# Altium project STPedal.PrjPcb
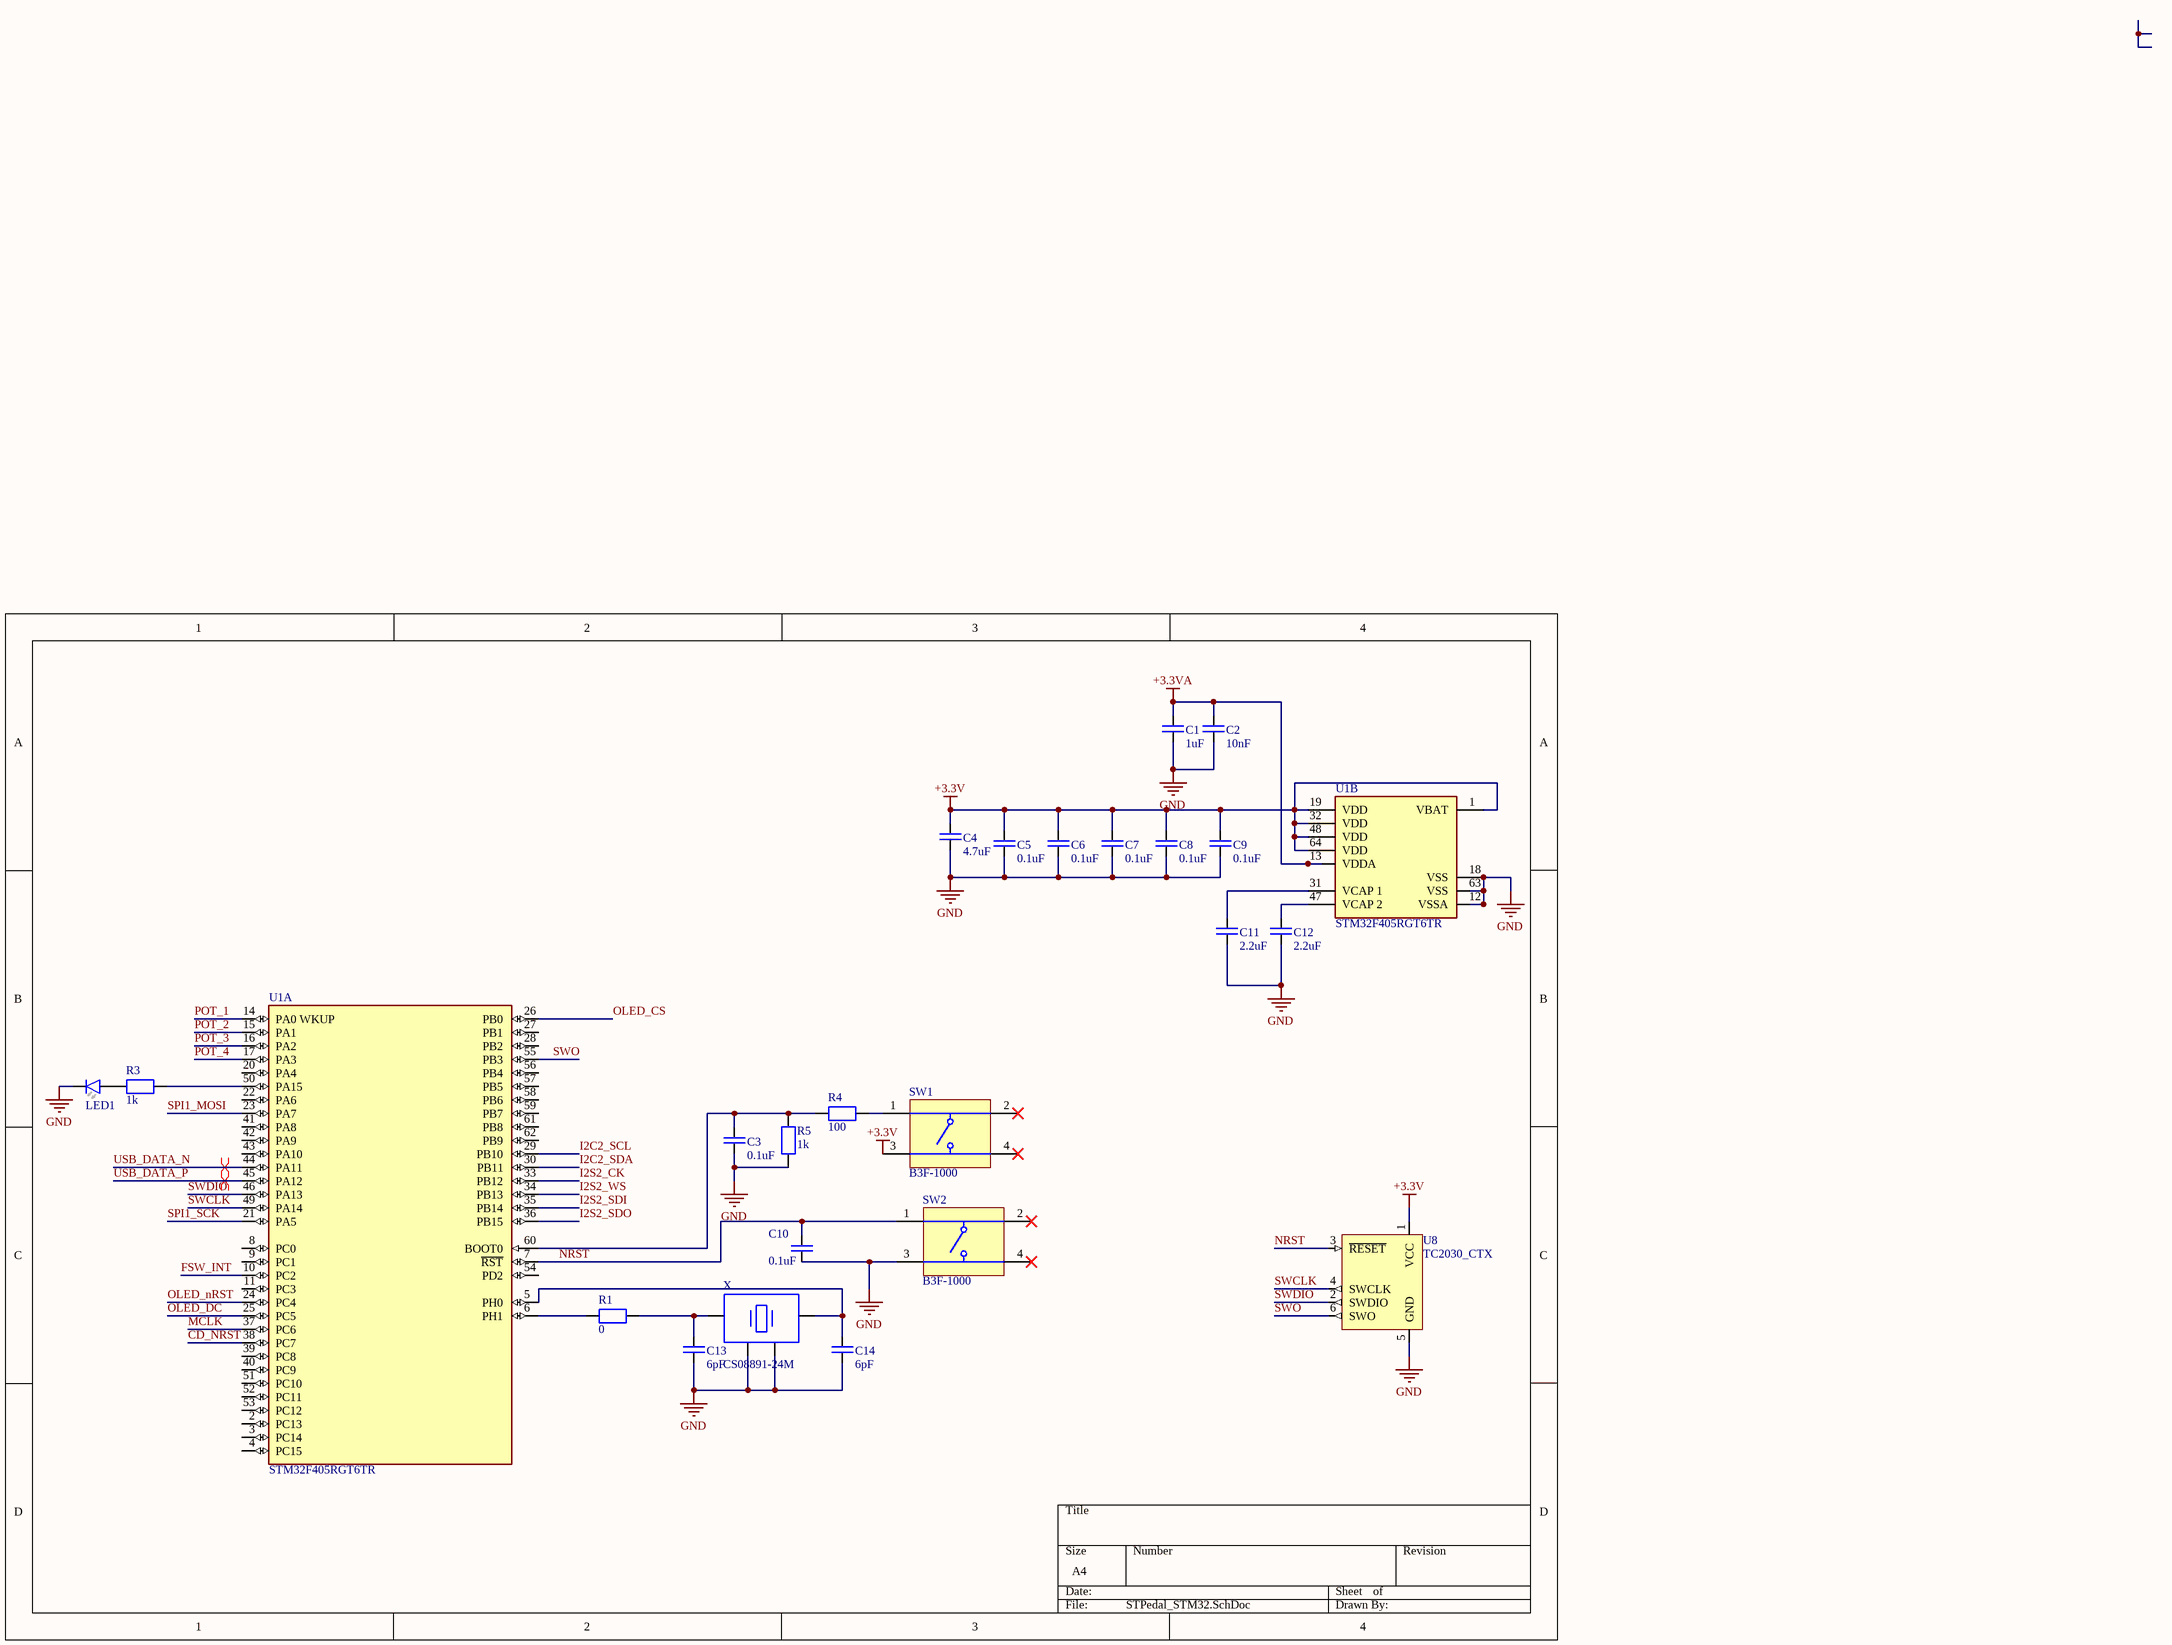
[diagram p0: STPedal_STM32.SchDoc]
4 sheets, 146 parts. Net scope: global (net labels, ports and power ports of the same name join across sheets).
Board file: STPedal.PcbDoc
Sheets:
  STPedal_STM32.SchDoc
  STPedal_Audio.SchDoc
  STPedal_Power.SchDoc
  STPedal_Peripherals.SchDoc

## Sheet STPedal_STM32.SchDoc
size A4; SheetNumber: 1; SheetTotal: 4

### Parts
C1  1uF  [CAPC_0402_1005X55N]
C2  10nF  [CAPC_0402_1005X55N]
C3  0.1uF  [CAPC_0402_1005X55N]
C4  4.7uF  [CAPC_0402_1005X55N]
C5  0.1uF  [CAPC_0402_1005X55N]
C6  0.1uF  [CAPC_0402_1005X55N]
C7  0.1uF  [CAPC_0402_1005X55N]
C8  0.1uF  [CAPC_0402_1005X55N]
C9  0.1uF  [CAPC_0402_1005X55N]
C10  0.1uF  [CAPC_0402_1005X55N]
C11  2.2uF  [CAPC_0402_1005X55N]
C12  2.2uF  [CAPC_0402_1005X55N]
C13  6pF  [CAPC_0402_1005X55N]
C14  6pF  [CAPC_0402_1005X55N]
LED1  LED_White_JLCD_0603  [LED_0603_1608]  (value not drawn)
R1  0  [RESC_0402_1005X40N]
R3  1k  [RESC_0402_1005X40N]
R4  100  [RESC_0402_1005X40N]
R5  1k  [RESC_0402_1005X40N]
SW1  B3F-1000  [OMRON-B3F-1000-4_V]
SW2  B3F-1000  [OMRON-B3F-1000-4_V]
U1  STM32F405RGT6TR  [FP-LQFP64-5W-IPC_C]  (parts A,B of 2)
U8  TC2030_CTX  [TC2030_CTX]  (no BOM)
X  CS08891-24M  [4 SMD - No Lead]

### Nets
+3.3V: C4.2 C5.2 C6.2 C7.2 C8.2 C9.2 SW1.3 U1.1(VBAT) U1.19(VDD) U1.32(VDD) U1.48(VDD) U1.64(VDD) U8.1(VCC)
+3.3VA: C1.2 C2.2 U1.13(VDDA)
GND: C1.1 C2.1 C3.1 C4.1 C5.1 C6.1 C7.1 C8.1 C9.1 C10.1 C11.1 C12.1 C13.1 C14.1 LED1.2 R5.1 SW2.3 U1.12(VSSA) U1.18(VSS) U1.63(VSS) U8.5(GND) X.2 X.4
CD_NRST: U1.38(PC7)
FSW_INT: U1.10(PC2)
I2C2_SCL: U1.29(PB10)
I2C2_SDA: U1.30(PB11)
I2S2_CK: U1.33(PB12)
I2S2_SDI: U1.35(PB14)
I2S2_SDO: U1.36(PB15)
I2S2_WS: U1.34(PB13)
MCLK: U1.37(PC6)
NRST: C10.2 SW2.1 U1.7(~{RST}) U8.3(~{RESET})
OLED_CS: U1.26(PB0)
OLED_DC: U1.25(PC5)
OLED_nRST: U1.24(PC4)
POT_1: U1.14(PA0_WKUP)
POT_2: U1.15(PA1)
POT_3: U1.16(PA2)
POT_4: U1.17(PA3)
SPI1_MOSI: U1.23(PA7)
SPI1_SCK: U1.21(PA5)
SWCLK: U1.49(PA14) U8.4(SWCLK)
SWDIO: U1.46(PA13) U8.2(SWDIO)
SWO: U1.55(PB3) U8.6(SWO)
USB_DATA_N: U1.44(PA11)
USB_DATA_P: U1.45(PA12)
NetC3_2: C3.2 R4.1 R5.2 U1.60(BOOT0)
NetC11_2: C11.2 U1.31(VCAP_1)
NetC12_2: C12.2 U1.47(VCAP_2)
NetC13_2: C13.2 R1.2 X.1
NetC14_2: C14.2 U1.5(PH0) X.3
NetLED1_1: LED1.1 R3.1
NetR1_1: R1.1 U1.6(PH1)
NetR3_2: R3.2 U1.50(PA15)
NetR4_2: R4.2 SW1.1

Not connected (* = marked no-connect by the designer): SW1 2* 4*; SW2 2* 4*; U1 2(PC13) 3(PC14) 4(PC15) 8(PC0) 9(PC1) 11(PC3) 20(PA4) 22(PA6) 27(PB1) 28(PB2) 39(PC8) 40(PC9) 41(PA8) 42(PA9) 43(PA10) 51(PC10) 52(PC11) 53(PC12) 54(PD2) 56(PB4) 57(PB5) 58(PB6) 59(PB7) 61(PB8) 62(PB9)

### Layout directives
differential pair: USB_DATA_N, USB_DATA_P

### Library data of the parts
C1 = 1uF_CAP_0402: Capacitor 0402 - 1uF +-/10% / 25V; Manufacturer: Samsung Electro-Mechanics; MPN: CL05A105KA5NQNC; LCSC: C52923
C2 = 10nF_CAP_0402: Capacitor 0402 - 10nF +-/10% / 25V; Manufacturer: Samsung Electro-Mechanics; MPN: CL05B103KB5NNNC; LCSC: C15195
C3 C5-C10 = 0.1uF_CAP_0402: Capacitor 0402 - 0.1uF +-/10% / 16V; Manufacturer: Samsung Electro-Mechanics; MPN: CL05B104KO5NNNC; LCSC: C1525
C4 = 4.7uF_CAP_0402: Capacitor 0402 - 4.7uF +-/20% / 10V; Manufacturer: Samsung Electro-Mechanics; MPN: CL05A475MP5NRNC; LCSC: C23733
C11 C12 = 2.2uF_CAP_0402: Capacitor 0402 - 2.2uF +-/10% / 25V; Manufacturer: Samsung Electro-Mechanics; MPN: CL05A225MQ5NSNC; LCSC: C12530
C13 C14 = 6pF_CAP_0402: Capacitor 0402 - 6pF +-/10% / 50V - C0G; Manufacturer: FH (Guangdong Fenghua Advanced Tech); MPN: 0402CG6R0C500NT; LCSC: C1575
LED1 = LED_White_JLCD_0603: -40℃~+85℃ 100mW 120° 2.6V~3.1V 360mcd 5mA Discrete Diode Top-mount White Yellow Lens 0603 LED Indication - Discrete ROHS; Manufacturer: Hubei KENTO Elec; MPN: KT-0603W; LCSC: C2290
R1 = 0R_JLCRES-0402: -55℃~+155℃ 0Ω 50V 62.5mW Thick Film Resistor ±1% ±800ppm/℃ 0402 Chip Resistor - Surface Mount ROHS; Manufacturer: UNI-ROYAL(Uniroyal Elec); MPN: 0402WGF0000TCE; LCSC: C17168
R3 R5 = 1k_JLCRES-0402: Resistor 0402 - 1k; Manufacturer: UNI-ROYAL(Uniroyal Elec); MPN: 0402WGF1001TCE; LCSC: C11702
R4 = 100R_JLCRES-0402: Resistor 0402 - 100R; Manufacturer: *; MPN: *; LCSC: C25076
SW1 SW2 = CMP-011-00004-2: Tactile Switch, SPST-NO, 0.05 A, 24 V, -25 to 70 degC, 4-Pin THD, RoHS, Bulk; Manufacturer: Omron Electronic Components; Throw Configuration: SPST; Max Contact Resistance: 100mohm; Resistance: 0.1Ohm; Max Current Rating: 50mA; Voltage Rating: 24V; Operating Force: 100gf; Datasheet Version: Jan-15; Case/Package: B3F-1000; Packaging: Bulk; Package Description: 4-Pin Through Hole Device, Body 6 x 6 mm; Manufacturer URL: http://www.omron.com/; Package Reference: B3F-1000; Contact Plating: Gold; Contact Current Rating: 50mA; RoHS Compliant: True; Contact Material: Gold; Mounting Technology: TH; Max Operating Temperature: 70°C; Min Operating Temperature: -25°C; Package Quantity: 1500; Datasheet URL: http://www.omron.com/ecb/products/pdf/en-b3f.pdf; Voltage Rating (DC): 24V; Pins: 4; Current Rating: 50mA; Max Voltage Rating (DC): 24V
U1 = CMP-0243-00156-2: IC MCU 32BIT 1MB FLASH 64LQFP; Frequency: 168MHz; Number of SPI Channels: 3; Oscillator Type: Internal; Core Architecture: ARM; Number of UART Channels: 2; Max Supply Voltage: 3.6V; Watchdog Timer: Yes; RAM Size: 196KB; Interface: I2C; Max Power Dissipation: 435mW; Number of Timers/Counters: 14; Data Bus Width: 32b; Peripherals: Brown-out Detect/Reset; Number of ADC Channels: 16; Min Supply Voltage: 1.8V; Number of Programmable I/O: 51; Memory Size: 1024KB; Max Operating Temperature: 85°C; Package Quantity: 1000; Lead Free: Lead Free; Memory Type: FLASH; Case/Package: LQFP; Number of I2C Channels: 3; Contact Plating: Tin; Mount: Surface Mount; Min Operating Temperature: -40°C; Radiation Hardening: No; Number of USB Channels: 2; Packaging: Tape and Reel; Height: 1.45mm; Number of Pins: 64; Number of I/Os: 51; Max Frequency: 168MHz; Width: 10mm; Length: 10mm
X = CS08891-24M: CRYSTAL 24.0000MHZ 6PF SMD

## Sheet STPedal_Audio.SchDoc
size A4; SheetNumber: 2; SheetTotal: 4
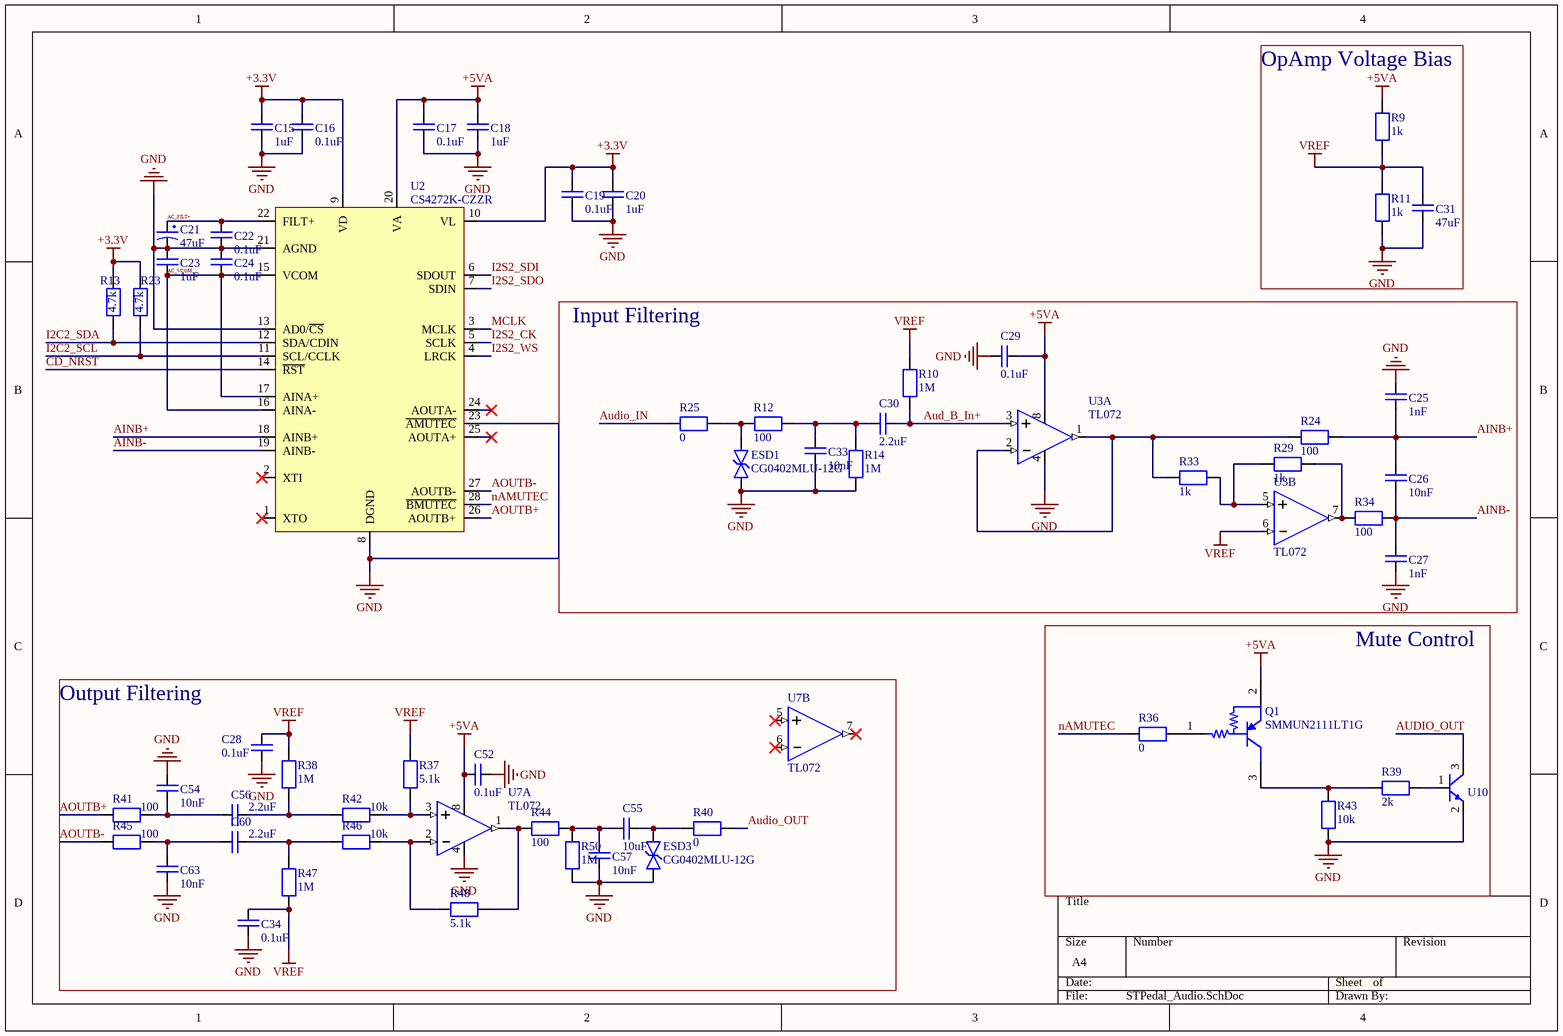
[diagram p1: STPedal_Audio.SchDoc]

### Parts
C15  1uF  [CAPC_0402_1005X55N]
C16  0.1uF  [CAPC_0402_1005X55N]
C17  0.1uF  [CAPC_0402_1005X55N]
C18  1uF  [CAPC_0402_1005X55N]
C19  0.1uF  [CAPC_0402_1005X55N]
C20  1uF  [CAPC_0402_1005X55N]
C21  47uF  [SMD,D6.3xL5.4mm]
C22  0.1uF  [CAPC_0402_1005X55N]
C23  1uF  [CAPC_0402_1005X55N]
C24  0.1uF  [CAPC_0402_1005X55N]
C25  1nF  [CAPC_0402_1005X55N]
C26  10nF  [CAPC_0402_1005X55N]
C27  1nF  [CAPC_0402_1005X55N]
C28  0.1uF  [CAPC_0402_1005X55N]
C29  0.1uF  [CAPC_0402_1005X55N]
C30  2.2uF  [CAPC_0402_1005X55N]
C31  47uF  [CAPC_0805_2012X145N]
C33  10nF  [CAPC_0402_1005X55N]
C34  0.1uF  [CAPC_0402_1005X55N]
C52  0.1uF  [CAPC_0402_1005X55N]
C54  10nF  [CAPC_0402_1005X55N]
C55  10uF  [RESC_0603_1608X55N]
C56  2.2uF  [CAPC_0402_1005X55N]
C57  10nF  [CAPC_0402_1005X55N]
C60  2.2uF  [CAPC_0402_1005X55N]
C63  10nF  [CAPC_0402_1005X55N]
ESD1  CG0402MLU-12G  [DIOC_0402_1005X41N]
ESD3  CG0402MLU-12G  [DIOC_0402_1005X41N]
Q1  SMMUN2111LT1G  [ONSC-SOT-23-3-318-08_V]
R9  1k  [RESC_0402_1005X40N]
R10  1M  [RESC_0402_1005X40N]
R11  1k  [RESC_0402_1005X40N]
R12  100  [RESC_0402_1005X40N]
R13  4.7k  [RESC_0402_1005X40N]
R14  1M  [RESC_0402_1005X40N]
R23  4.7k  [RESC_0402_1005X40N]
R24  100  [RESC_0402_1005X40N]
R25  0  [RESC_0402_1005X40N]
R29  1k  [RESC_0402_1005X40N]
R33  1k  [RESC_0402_1005X40N]
R34  100  [RESC_0402_1005X40N]
R36  0  [RESC_0402_1005X40N]
R37  5.1k  [RESC_0402_1005X40N]
R38  1M  [RESC_0402_1005X40N]
R39  2k  [RESC_0402_1005X40N]
R40  0  [RESC_0402_1005X40N]
R41  100  [RESC_0402_1005X40N]
R42  10k  [RESC_0402_1005X40N]
R43  10k  [RESC_0402_1005X40N]
R44  100  [RESC_0402_1005X40N]
R45  100  [RESC_0402_1005X40N]
R46  10k  [RESC_0402_1005X40N]
R47  1M  [RESC_0402_1005X40N]
R48  5.1k  [RESC_0402_1005X40N]
R50  1M  [RESC_0402_1005X40N]
U2  CS4272K-CZZR  [TSOP65P640X120-28N]
U3  TL072  [SO-8]  (parts A,B of 2)
U7  TL072  [SO-8]  (parts A,B of 2)
U10  FMMT619  [SOT95P240X115-3N]  (value not drawn)

### Blocks framed on the sheet
OpAmp Voltage Bias: C31 R9 R11
Input Filtering: C25-C27 C29 C30 C33 ESD1 R10 R12 R14 R24 R25 R29 R33 R34 U3
Mute Control: Q1 R36 R39 R43 U10
Output Filtering: C28 C34 C52 C54-C57 C60 C63 ESD3 R37 R38 R40-R42 R44-R48 R50 U7

### Nets
+3.3V: C15.2 C16.2 C19.2 C20.2 R13.2 R23.2 U2.9(VD) U2.10(VL)
+5VA: C17.2 C18.2 C29.1 C52.1 Q1.2(E) R9.2 U2.20(VA) U3.8 U7.8
GND: C15.1 C16.1 C17.1 C18.1 C19.1 C20.1 C21.2 C22.1 C23.2 C24.2 C25.1 C27.2 C28.2 C29.2 C31.1 C33.1 C34.2 C52.2 C54.2 C57.1 C63.1 ESD1.1 ESD3.1 R11.1 R14.1 R43.2 R50.1 U2.8(DGND) U2.13(AD0/~{CS}) U2.21(AGND) U2.23(~{AMUTEC}) U3.4 U7.4 U10.2
VREF: C28.1 C31.2 C34.1 R9.1 R10.2 R11.2 R37.2 R38.2 R47.1 U3.6
AC_FILT+: C21.1 C22.2 U2.22(FILT+)
AC_VCOM: C23.1 C24.1 U2.15(VCOM) U2.16(AINA-) U2.17(AINA+)
AINB+: C25.2 C26.2 R24.2 U2.18(AINB+)
AINB-: C26.1 C27.1 R34.2 U2.19(AINB-)
AOUTB+: R41.1 U2.26(AOUTB+)
AOUTB-: R45.1 U2.27(AOUTB-)
Aud_B_In+: C30.2 R10.1 U3.3
Audio_IN: R25.1
AUDIO_OUT: R40.2 U10.3
CD_NRST: U2.14(~{RST})
I2C2_SCL: R23.1 U2.11(SCL/CCLK)
I2C2_SDA: R13.1 U2.12(SDA/CDIN)
I2S2_CK: U2.5(SCLK)
I2S2_SDI: U2.6(SDOUT)
I2S2_SDO: U2.7(SDIN)
I2S2_WS: U2.4(LRCK)
MCLK: U2.3(MCLK)
nAMUTEC: R36.1 U2.28(~{BMUTEC})
NetC30_1: C30.1 C33.2 R12.2 R14.2
NetC54_1: C54.1 C56.1 R41.2
NetC55_1: C55.1 ESD3.2 R40.1
NetC55_2: C55.2 C57.2 R44.2 R50.2
NetC56_2: C56.2 R38.1 R42.1
NetC60_1: C60.1 C63.2 R45.2
NetC60_2: C60.2 R46.1 R47.2
NetESD1_2: ESD1.2 R12.1 R25.2
NetQ1_1: Q1.1(B) R36.2
NetQ1_3: Q1.3(C) R39.1 R43.1
NetR24_1: R24.1 R33.1 U3.1 U3.2
NetR29_1: R29.1 R33.2 U3.5
NetR29_2: R29.2 R34.1 U3.7
NetR37_1: R37.1 R42.2 U7.3
NetR39_2: R39.2 U10.1
NetR44_1: R44.1 R48.1 U7.1
NetR46_2: R46.2 R48.2 U7.2

Not connected (* = marked no-connect by the designer): U2 1(XTO)* 2(XTI)* 24(AOUTA-)* 25(AOUTA+)*; U7 5* 6* 7*

### Library data of the parts
C15 C18 C20 C23 = 1uF_CAP_0402: as C1 on sheet STPedal_STM32; LCSC: C52923
C16 C17 C19 C22 C24 C28 C29 C34 C52 = 0.1uF_CAP_0402: as C3 on sheet STPedal_STM32; LCSC: C1525
C21 = 47uF_JLCAP_Elect_D6.3mm: -55℃~+105℃ 2000hrs@105℃ 35V 47uF 5.4mm 6.3mm ±20% SMD,D6.3xL5.4mm Aluminum Electrolytic Capacitors - SMD ROHS; Manufactuer: Honor Elec; MPN: RVT1V470M0605; LCSC: C3344
C25 C27 = 1nF_CAP_0402: 1nF 50V X7R ±10% 0402 Multilayer Ceramic Capacitors MLCC - SMD/SMT ROHS; Manufacturer: FH (Guangdong Fenghua Advanced Tech); MPN: 0402B102K500NT; LCSC: C1523
C26 C33 C54 C57 C63 = 10nF_CAP_0402: as C2 on sheet STPedal_STM32; LCSC: C15195
C30 C56 C60 = 2.2uF_CAP_0402: as C11 on sheet STPedal_STM32; LCSC: C12530
C31 = 47uF_CAP_0805: 47uF 6.3V X5R ±20% 0805 Multilayer Ceramic Capacitors MLCC - SMD/SMT ROHS; Manufacturer: Samsung Electro-Mechanics; MPN: CL21A476MQYNNNE; LCSC: C16780
C55 = 10uF_CAP_0603: Capacitor 0603 - 0.1uF +-/10% / 25V; Manufacturer: Samsung Electro-Mechanics; MPN: CL10A106MA8NRNC; LCSC: C96446
ESD1 ESD3 = CG0402MLU-12G: -40℃~+125℃ 0.05pF 1 12V 25V 5nA ESD IEC 61000-4-2 0402 ESD and Surge Protection (TVS/ESD) ROHS; Manufacturer: BOURNS; MPN: CG0402MLU-12G; LCSC: C2655716
Q1 = CMP-0630-00261-1: Digital Transistor (BRT), R1=10 kOhm, R2=10 kOhm, PNP Transistor, 3-Pin SOT-23, Pb-Free, Tape and Reel; Manufacturer: On Semiconductor; V(BR)CEO Min (V): 50; IC Continuous (A): 0.1; hFE Min: 35; R1/R2 Typ: 1; Mounting Technology: Surface Mount; ComponentLink1Description: Manufacturer URL; ComponentLink1URL: http://www.onsemi.com/; Polarity: PNP; ComponentLink3URL: http://www.onsemi.cn/pub_link/Collateral/318-08.PDF; RoHS: TRUE; ComponentLink3Description: Package Specification; DatasheetVersion: Rev. 7; PackageReference: SOT-23-3-318-08; PackageVersion: Rev. AP, 11/2009; ComponentLink2Description: Datasheet; ComponentLink2URL: http://www.onsemi.cn/pub_link/Collateral/DTA114E-D.PDF; PackageDescription: 3-Pin Small Outline Transistor, Body 2.92 x 1.3 mm, Pitch 0.95 mm; PartNumber: SMMUN2111LT1G; Packing: Tape and Reel; LCSC: C894362
R9 R11 R29 R33 = 1k_JLCRES-0402: as R3 on sheet STPedal_STM32; LCSC: C11702
R10 R14 R38 R47 R50 = 1M_JLCRES-0402: -55℃~+155℃ 1MΩ 50V 62.5mW Thick Film Resistor ±1% ±100ppm/℃ 0402 Chip Resistor - Surface Mount ROHS; Manufacturer: UNI-ROYAL(Uniroyal Elec); MPN: 0402WGF1004TCE; LCSC: C26083
R12 R24 R34 R41 R44 R45 = 100R_JLCRES-0402: Resistor 0402 - 100R; Manufacturer: *; MPN: *; LCSC: C25076
R13 R23 = 4.7k_JLCRES-0402: -55℃~+155℃ 4.7kΩ 50V 62.5mW Thick Film Resistor ±1% ±100ppm/℃ 0402 Chip Resistor - Surface Mount ROHS; Manufacturer: UNI-ROYAL(Uniroyal Elec); MPN: 0402WGF4701TCE; LCSC: C25900
R25 R36 R40 = 0R_JLCRES-0402: as R1 on sheet STPedal_STM32; LCSC: C17168
R37 R48 = 5.1k_JLCRES-0402: -55℃~+155℃ 5.1kΩ 50V 62.5mW Thick Film Resistor ±1% ±100ppm/℃ 0402 Chip Resistor - Surface Mount ROHS; Manufacturer: UNI-ROYAL(Uniroyal Elec); MPN: 0402WGF5101TCE; LCSC: C25905
R39 = 2k_JLCRES-0402: -55℃~+155℃ 2kΩ 50V 62.5mW Thick Film Resistor ±1% ±100ppm/℃ 0402 Chip Resistor - Surface Mount ROHS; Manufacturer: UNI-ROYAL(Uniroyal Elec); MPN: 0402WGF2001TCE; LCSC: C4109
R42 R43 R46 = 10k_JLCRES-0402: -55℃~+155℃ 10kΩ 50V 62.5mW Thick Film Resistor ±1% ±100ppm/℃ 0402 Chip Resistor - Surface Mount ROHS; Manufacturer: UNI-ROYAL(Uniroyal Elec); MPN: 0402WGF1002TCE; LCSC: C25744
U2 = CS4272K-CZZR: -10℃~+70℃ 2.37V~5.25V、3.1V~5.25V、4.75V~5.25V 4kHz~192kHz Encoder/decoder On-chip digital gain、Mute control、Master-slave clock negotiation Serial TSSOP-28 Audio Interface ICs ROHS; Manufactuer: Cirrus Logic; MPN: CS4272K-CZZR; LCSC: C17197186; ComponentLink1Description: Datasheet; ComponentLink1URL: https://statics.cirrus.com/pubs/proDatasheet/CS4272_F2.pdf
U3 U7 = TL072CDT: 0℃~+70℃ 1.4mA 10uV/℃ 15nV/√Hz@1kHz 16V/us 2 20pA 36V 3mV 40mA 4MHz 5pA 6V~36V 86dB SO-8 FET Input Amplifiers ROHS; Manufacturer: STMicroelectronics; MPN: TL072CDT; LCSC: C6961
U10 = FMMT619_JLC_SOT23: -55℃~+150℃ 1 NPN 100nA 165MHz 200 200mV 2A 50V 625mW 7V NPN SOT-23 Bipolar (BJT) ROHS; Manufacturer: Diodes Incorporated; MPN: FMMT619TA; ComponentLink1Description: New link; ComponentLink1URL: *; LCSC: C15331

## Sheet STPedal_Power.SchDoc
size A4; SheetNumber: 3; SheetTotal: 4
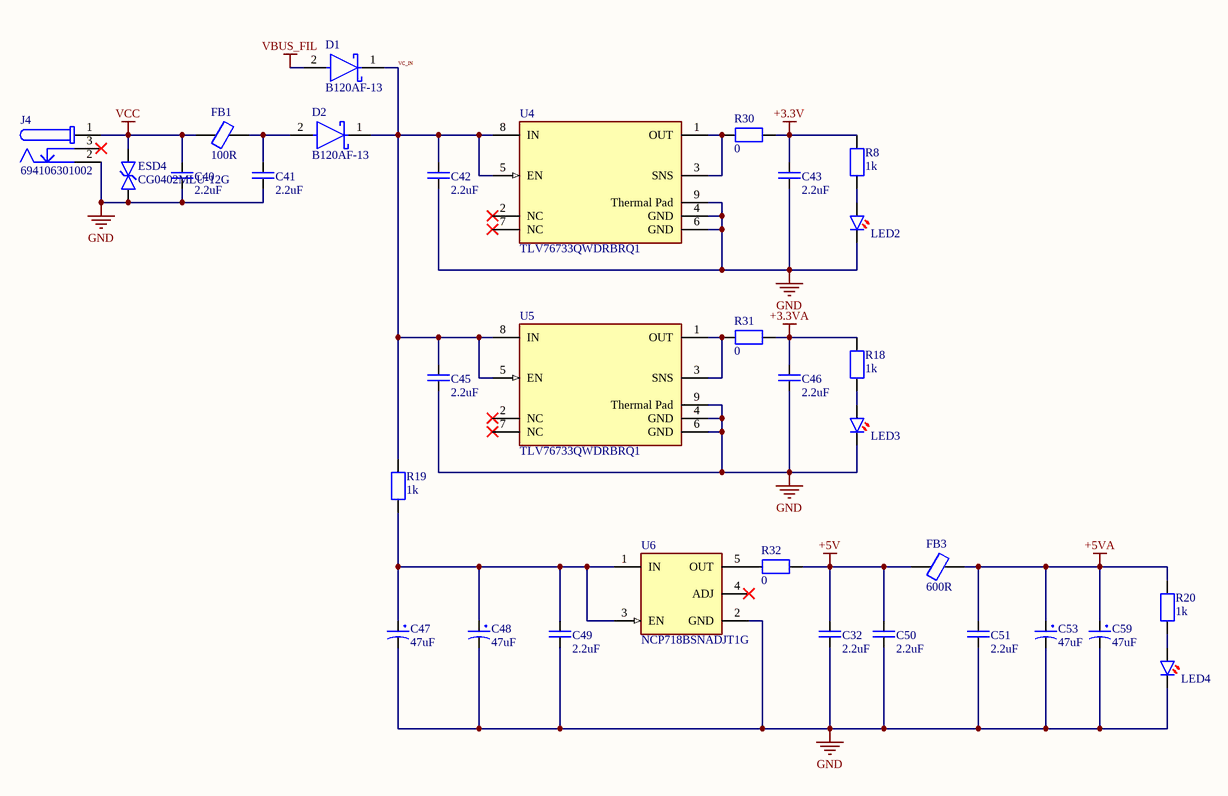
[diagram p2: STPedal_Power.SchDoc]

### Parts
C32  2.2uF  [CAPC_0402_1005X55N]
C40  2.2uF  [CAPC_0402_1005X55N]
C41  2.2uF  [CAPC_0402_1005X55N]
C42  2.2uF  [CAPC_0402_1005X55N]
C43  2.2uF  [CAPC_0402_1005X55N]
C45  2.2uF  [CAPC_0402_1005X55N]
C46  2.2uF  [CAPC_0402_1005X55N]
C47  47uF  [SMD,D6.3xL5.4mm]
C48  47uF  [SMD,D6.3xL5.4mm]
C49  2.2uF  [CAPC_0402_1005X55N]
C50  2.2uF  [CAPC_0402_1005X55N]
C51  2.2uF  [CAPC_0402_1005X55N]
C53  47uF  [SMD,D6.3xL5.4mm]
C59  47uF  [SMD,D6.3xL5.4mm]
D1  B120AF-13  [FP-SMAF-MFG]
D2  B120AF-13  [FP-SMAF-MFG]
ESD4  CG0402MLU-12G  [DIOC_0402_1005X41N]
FB1  100R  [FBC_0805_2012X105N]
FB3  600R  [FBC_0805_2012X105N]
J4  694106301002  [694106301002]
LED2  LED_Red_JLCD_0603  [LED_0603_1608]  (value not drawn)
LED3  LED_Red_JLCD_0603  [LED_0603_1608]  (value not drawn)
LED4  LED_Red_JLCD_0603  [LED_0603_1608]  (value not drawn)
R8  1k  [RESC_0402_1005X40N]
R18  1k  [RESC_0402_1005X40N]
R19  1k  [RESC_0402_1005X40N]
R20  1k  [RESC_0402_1005X40N]
R30  0  [RESC_0402_1005X40N]
R31  0  [RESC_0402_1005X40N]
R32  0  [RESC_0402_1005X40N]
U4  TLV76733QWDRBRQ1  [FP-DRB0008J-IPC_C]
U5  TLV76733QWDRBRQ1  [FP-DRB0008J-IPC_C]
U6  NCP718BSNADJT1G  [FP-419AE-01-IPC_C]

### Nets
+3.3V: C43.2 R8.2 R30.2
+3.3VA: C46.2 R18.2 R31.2
+5V: C32.2 C50.2 FB3.1 R32.2
+5VA: C51.2 C53.1 C59.1 FB3.2 R20.1
GND: C32.1 C40.1 C41.1 C42.1 C43.1 C45.1 C46.1 C47.2 C48.2 C49.1 C50.1 C51.1 C53.2 C59.2 ESD4.1 J4.2 LED2.2 LED3.2 LED4.2 U4.4(GND) U4.6(GND) U4.9(Thermal_Pad) U5.4(GND) U5.6(GND) U5.9(Thermal_Pad) U6.2(GND)
VBUS_FIL: D1.2(A)
VCC: C40.2 ESD4.2 FB1.1 J4.1
VC_IN: C42.2 C45.2 D1.1(C) D2.1(C) R19.2 U4.5(EN) U4.8(IN) U5.5(EN) U5.8(IN)
NetC41_2: C41.2 D2.2(A) FB1.2
NetC47_1: C47.1 C48.1 C49.2 R19.1 U6.1(IN) U6.3(EN)
NetLED2_1: LED2.1 R8.1
NetLED3_1: LED3.1 R18.1
NetLED4_1: LED4.1 R20.2
NetR30_1: R30.1 U4.1(OUT) U4.3(SNS)
NetR31_1: R31.1 U5.1(OUT) U5.3(SNS)
NetR32_1: R32.1 U6.5(OUT)

Not connected (* = marked no-connect by the designer): J4 3*; U4 2(NC)* 7(NC)*; U5 2(NC)* 7(NC)*; U6 4(ADJ)*

### Library data of the parts
C32 C40-C43 C45 C46 C49-C51 = 2.2uF_CAP_0402: as C11 on sheet STPedal_STM32; LCSC: C12530
C47 C48 C53 C59 = 47uF_JLCAP_Elect_D6.3mm: as C21 on sheet STPedal_Audio; LCSC: C3344
D1 D2 = CMP-12790-000092-1: DIODE SCHOTTKY 20V 1A SMAF; Average Rectified Current: 1A; Packaging: Tape and Reel; Mount: Surface Mount; Max Reverse Voltage (DC): 20V; RoHS Compliant: Yes; LCSC: C5125499
ESD4 = CG0402MLU-12G: as ESD1 on sheet STPedal_Audio; MPN: CG0402MLU-12G; LCSC: C2655716
FB1 FB3 = 600@100MHz_JLCFB_0805: -55℃~+125℃ 1 300mΩ 500mA 600Ω@100MHz ±25% 0805 Ferrite Beads ROHS; Manufacturer: Sunlord; MPN: GZ2012D601TF; LCSC: C1017
J4 = CMP-1502-00188-3: DC Power Jack Connector WR-DC, Male, Right Angled, THT, 5 A, 24 V; Operating Supply Voltage: 24V; Shielding: Unshielded; Current Rating: 5A; Number of Contacts: 3; Insulation Resistance: 100MΩ; Termination: Through Hole; RoHS: Compliant; Contact Plating: Tin; Connector Type: Power; Contact Material: Gold, Tin; Packaging: Bulk; Min Operating Temperature: -40°C; REACH SVHC: Unknown; Housing Material: Polyamide; Contact Gender: Female; Height: 11mm; Gender: Male; Color: Black; Voltage Rating: 24V; Flammability Rating: UL94 V-0; Max Operating Temperature: 85°C; Mount: Through Hole; LCSC: C5441017
LED2-LED4 = LED_Red_JLCD_0603: -40℃~+85℃ 1.8V~2.4V 120° 20mA 300mcd 40mW 615nm~630nm 645nm Discrete Diode Red Water Clear 0603 LED Indication - Discrete ROHS; Manufacturer: Hubei KENTO Elec; MPN: KT-0603R; LCSC: C2286
R8 R18 R20 = 1k_JLCRES-0402: as R3 on sheet STPedal_STM32; LCSC: C11702
R19 = 100R_JLCRES-0402: Resistor 0402 - 100R; Manufacturer: *; MPN: *; LCSC: C25076
R30-R32 = 0R_JLCRES-0402: as R1 on sheet STPedal_STM32; LCSC: C17168
U4 U5 = CMP-04917-000370-1: IC OPAMP; RoHS Compliant: Yes
U6 = CMP-07128-000004-1: -40℃~+125℃@(Tj) 1 24V 250mV@(300mA) 300mA 36uVrms 4uA 5V 60dB@(1kHz) Fixed Over Current Protection、Over Temperature Protection、Enable Positive TSOT-23-5 Voltage Regulators - Linear, Low Drop Out (LDO) Regulators ROHS; Manufacturer Part Number: NCP718BSN500T1G; Manufacturer: On Semiconductor; Min Supply Voltage: 2.5V; Max Junction Temp: +125°C; Nominal Supply Current: 50-300uA; Dropout Voltage: 480mV; Accuracy Percentage: 2%; Standoff Height: 0.01mm; Number Of Outputs: 1; Max Supply Voltage: 24V; Output Type: Fixed; Lead Free: Yes; Temperature: to +125°C; ComponentLink2URL: https://www.onsemi.com/pub/Collateral/NCP718-D.PDF; Height: 1mm; ComponentLink2Description: Datasheet; Octopart: https://octopart.com/ncp718bsnadjt1g-on+semiconductor-87658781; Device Class L1: Integrated Circuits (ICs); Device Class L2: Power Management ICs; Output Voltage: 5V; Device Class L3: Voltage Regulators - Linear; Digikey Description: IC REG LINEAR 5V 300MA TSOT-23-5; Temperature Range High: +125°C; Package: 419AE-01; Output Current: 300mA; Mouser Description: LDO Regulator, 300 mA, Wide Vin, Ultra-Low Iq Adjustable, Non-Active Discharge, TSOT23-5; Category: IC; Automotive: No; RoHS: TRUE; LCSC: C892796

## Sheet STPedal_Peripherals.SchDoc
size A4; SheetNumber: 4; SheetTotal: 4
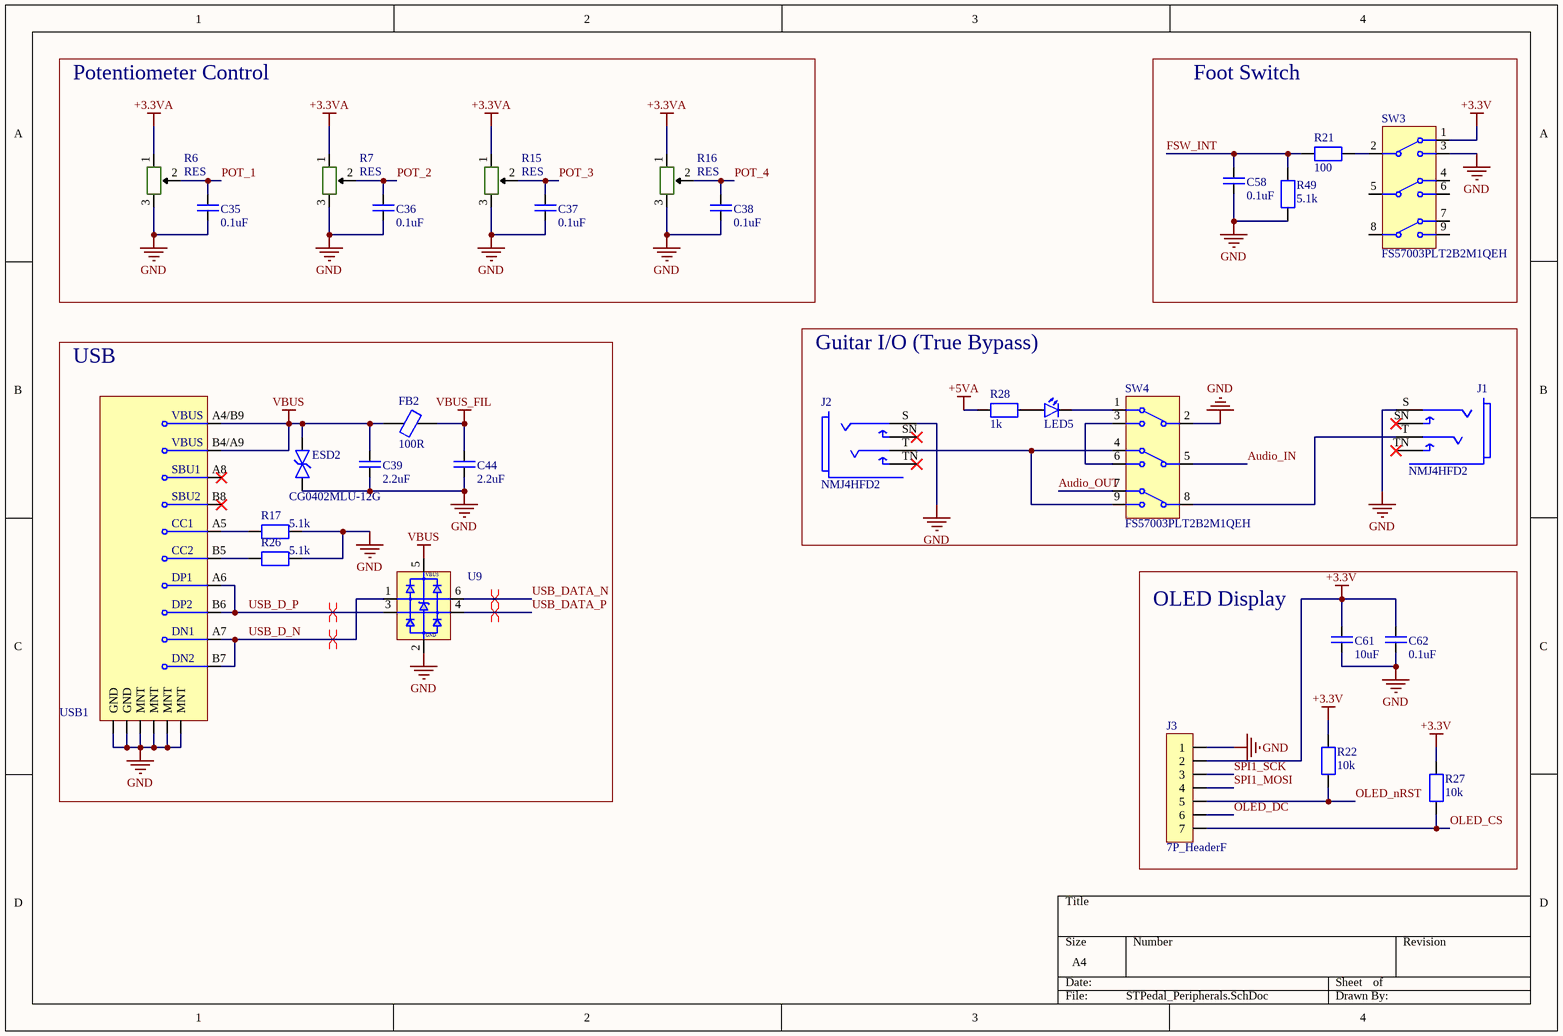
[diagram p3: STPedal_Peripherals.SchDoc]

### Parts
C35  0.1uF  [CAPC_0402_1005X55N]
C36  0.1uF  [CAPC_0402_1005X55N]
C37  0.1uF  [CAPC_0402_1005X55N]
C38  0.1uF  [CAPC_0402_1005X55N]
C39  2.2uF  [CAPC_0402_1005X55N]
C44  2.2uF  [CAPC_0402_1005X55N]
C58  0.1uF  [CAPC_0402_1005X55N]
C61  10uF  [RESC_0603_1608X55N]
C62  0.1uF  [CAPC_0402_1005X55N]
ESD2  CG0402MLU-12G  [DIOC_0402_1005X41N]
FB2  100R  [FBC_0805_2012X105N]
J1  NMJ4HFD2  [FP-NMJ4HFD2-MFG]  (no BOM)
J2  NMJ4HFD2  [FP-NMJ4HFD2-MFG]  (no BOM)
J3  7P_HeaderF  [7P_2.54]  (no BOM)
LED5  LED_5mm_THT  [LED_THT_5mm]  (value not drawn)  (no BOM)
R6  RES  [PTV09A-4020S-B104]  (no BOM)
R7  RES  [PTV09A-4020S-B104]  (no BOM)
R15  RES  [PTV09A-4020S-B104]  (no BOM)
R16  RES  [PTV09A-4020S-B104]  (no BOM)
R17  5.1k  [RESC_0402_1005X40N]
R21  100  [RESC_0402_1005X40N]
R22  10k  [RESC_0402_1005X40N]
R26  5.1k  [RESC_0402_1005X40N]
R27  10k  [RESC_0402_1005X40N]
R28  1k  [RESC_0402_1005X40N]
R49  5.1k  [RESC_0402_1005X40N]
SW3  FS57003PLT2B2M1QEH  [3PDT_FootSwitch]  (no BOM)
SW4  FS57003PLT2B2M1QEH  [3PDT_FootSwitch]  (no BOM)
U9  USBLC6-2SC6_JLC  [SOT23-6L]  (value not drawn)
USB1  USB_C_JLC_16P  [USB_C_SMT_16P]  (value not drawn)

### Blocks framed on the sheet
Potentiometer Control: C35-C38 R6 R7 R15 R16
Foot Switch: C58 R21 R49 SW3
USB: C39 C44 ESD2 FB2 R17 R26 U9 USB1
Guitar I/O (True Bypass): J1 J2 LED5 R28 SW4
OLED Display: C61 C62 J3 R22 R27

### Nets
+3.3V: C61.2 C62.2 J3.2 R22.2 R27.2 SW3.1
+3.3VA: R6.1 R7.1 R15.1 R16.1
+5VA: R28.1
GND: C35.1 C36.1 C37.1 C38.1 C39.1 C44.1 C58.1 C61.1 C62.1 ESD2.1 J1.S J2.S J3.1 R6.3 R7.3 R15.3 R16.3 R17.2 R26.2 R49.1 SW3.3 SW4.2 U9.2 USB1.A1/B12(GND) USB1.B1/A12(GND) USB1.MNT1(MNT) USB1.MNT2(MNT) USB1.MNT3(MNT) USB1.MNT4(MNT)
VBUS: C39.2 ESD2.2 FB2.1 U9.5 USB1.A4/B9(VBUS) USB1.B4/A9(VBUS)
VBUS_FIL: C44.2 FB2.2
Audio_IN: SW4.5
AUDIO_OUT: SW4.7
FSW_INT: C58.2 R21.1 R49.2
OLED_CS: J3.7 R27.1
OLED_DC: J3.6
OLED_nRST: J3.5 R22.1
POT_1: C35.2 R6.2
POT_2: C36.2 R7.2
POT_3: C37.2 R15.2
POT_4: C38.2 R16.2
SPI1_MOSI: J3.4
SPI1_SCK: J3.3
USB_D_N: U9.1 USB1.A7(DN1) USB1.B7(DN2)
USB_D_P: U9.3 USB1.A6(DP1) USB1.B6(DP2)
USB_DATA_N: U9.6
USB_DATA_P: U9.4
NetJ1_T: J1.T SW4.8
NetJ2_T: J2.T SW4.4 SW4.9
NetLED5_1: LED5.1 R28.2
NetLED5_2: LED5.2 SW4.1
NetR17_1: R17.1 USB1.A5(CC1)
NetR21_2: R21.2 SW3.2
NetR26_1: R26.1 USB1.B5(CC2)
NetSW4_3: SW4.3 SW4.6

Not connected (* = marked no-connect by the designer): J1 SN* TN*; J2 SN* TN*; SW3 4 5 6 7 8 9; USB1 A8(SBU1)* B8(SBU2)*

### Layout directives
differential pair: USB_D_N, USB_D_P, USB_DATA_N, USB_DATA_P

### Notes on the sheet
- (in symbol USBLC6-2SC6_JLC) VBUS; GND

### Library data of the parts
C35-C38 C58 C62 = 0.1uF_CAP_0402: as C3 on sheet STPedal_STM32; LCSC: C1525
C39 C44 = 2.2uF_CAP_0402: as C11 on sheet STPedal_STM32; LCSC: C12530
C61 = 10uF_CAP_0603: as C55 on sheet STPedal_Audio; LCSC: C96446
ESD2 = CG0402MLU-12G: as ESD1 on sheet STPedal_Audio; MPN: CG0402MLU-12G; LCSC: C2655716
FB2 = 100@100MHz_JLCFB_0805: -55℃~+155℃ 5.1kΩ 50V 62.5mW Thick Film Resistor ±1% ±100ppm/℃ 0402 Chip Resistor - Surface Mount ROHS; Manufacturer: Sunlord; MPN: GZ2012D101TF; LCSC: C1015
J1 J2 = CMP-78736-000001-1: Conn 1/4" Mono Jack F 3 POS Solder RA Thru-Hole 3 Terminal 1 Port; Manufacturer: Neutrik; Number Of Contacts: 2; Current Rating: 0.5A; Voltage Rating: 50V; Conn Orientation: Horizontal; Is Female: yes; Temperature: -25°C to +70°C; ComponentLink2Description: Datasheet; ComponentLink2URL: https://www.neutrik.com/en/product/nmj4hfd2.pdf; Contact Material: Silver; Height: 15.89mm; Package: 0; Mouser Description: Phone Audio Connector, Socket, 2, PCB Mount, Metal Body, Silver Plated Contacts; Manufacturer Part Number: NMJ4HFD2; Automotive: No; RoHS: TRUE; Lead Free: Yes; Device Class L2: Audio / Video Connectors; Device Class L3: unset; Temperature Range Low: -25°C; Category: Conn; Footprint Url: https://www.neutrik.com/media/8576/download/st-nmj4hfd2.pdf?v=1; Temperature Range High: +70°C; Device Class L1: Connectors; Octopart: https://octopart.com/nmj4hfd2-neutrik-758952
J3 = 7P_FemaleHeader_2.54mm
LED5 = LED_5mm_THT: Generic THT 5mm led
R6 R7 R15 R16 = POT_Gen_5mm: Generic Potentiometer 5mm pitch; Manufacturer: *; MPN: *; LCSC: *
R17 R26 R49 = 5.1k_JLCRES-0402: as R37 on sheet STPedal_Audio; LCSC: C25905
R21 = 100R_JLCRES-0402: Resistor 0402 - 100R; Manufacturer: *; MPN: *; LCSC: C25076
R22 R27 = 10k_JLCRES-0402: as R42 on sheet STPedal_Audio; LCSC: C25744
R28 = 1k_JLCRES-0402: as R3 on sheet STPedal_STM32; LCSC: C11702
SW3 SW4 = FS57003PLT2B2M1QEH_FootSwitch_3PDT: SWITCH PUSHBUTTON 3PDT 1A 9V; Manufacturer: E-Switch; MPN: FS57003PLT2B2M1QEH; LCSC: C3315866; ComponentLink1Description: Digikey; ComponentLink1URL: https://www.digikey.co.nz/en/products/detail/e-switch/FS57003PLT2B2M1QEH/6825399?gclsrc=aw.ds&gad_source=1&gad_campaignid=17419957627&gbraid=0AAAAADrbLli30KpXhhNcZ1xqLjHYd0W2W&gclid=CjwKCAjwl97RBhBWEiwAa9rbXUauQOGKi4iSMkdk9_Y1NkU4OmdcWE9QqEc_UI5nVm6lPQILuOQigBoCCyUQAvD_BwE
U9 = USBLC6-2SC6_JLC: -40℃~+125℃ 150nA 17V 2 3.5pF 5.25V 5A 6V ESD IEC 61000-4-2 Unidirectional SOT-23-6L ESD and Surge Protection (TVS/ESD) ROHS; Manufacturer: STMicroelectronics; MPN: USBLC6-2SC6; LCSC: C7519
USB1 = USB_C_JLC_16P: -30℃~+80℃ 1 10,000 cycles 16P 20V 5A 7.35mm Female Surface Mount, Right Angle Type-C SMD USB Connectors ROHS; Manufacturer: Korean Hroparts Elec; MPN: TYPE-C-31-M-12; LCSC: C165948

## Nets that join several sheets
+3.3V: STPedal_STM32 (13 pins), STPedal_Audio (8 pins), STPedal_Power (C43.2 R8.2 R30.2), STPedal_Peripherals (6 pins)
+3.3VA: STPedal_STM32 (C1.2 C2.2 U1.13), STPedal_Power (C46.2 R18.2 R31.2), STPedal_Peripherals (R6.1 R7.1 R15.1 R16.1)
+5VA: STPedal_Audio (9 pins), STPedal_Power (5 pins), STPedal_Peripherals (R28.1)
GND: STPedal_STM32 (23 pins), STPedal_Audio (34 pins), STPedal_Power (26 pins), STPedal_Peripherals (29 pins)
VBUS_FIL: STPedal_Power (D1.2), STPedal_Peripherals (C44.2 FB2.2)
Audio_IN: STPedal_Audio (R25.1), STPedal_Peripherals (SW4.5)
AUDIO_OUT: STPedal_Audio (R40.2 U10.3), STPedal_Peripherals (SW4.7)
CD_NRST: STPedal_STM32 (U1.38), STPedal_Audio (U2.14)
FSW_INT: STPedal_STM32 (U1.10), STPedal_Peripherals (C58.2 R21.1 R49.2)
I2C2_SCL: STPedal_STM32 (U1.29), STPedal_Audio (R23.1 U2.11)
I2C2_SDA: STPedal_STM32 (U1.30), STPedal_Audio (R13.1 U2.12)
I2S2_CK: STPedal_STM32 (U1.33), STPedal_Audio (U2.5)
I2S2_SDI: STPedal_STM32 (U1.35), STPedal_Audio (U2.6)
I2S2_SDO: STPedal_STM32 (U1.36), STPedal_Audio (U2.7)
I2S2_WS: STPedal_STM32 (U1.34), STPedal_Audio (U2.4)
MCLK: STPedal_STM32 (U1.37), STPedal_Audio (U2.3)
OLED_CS: STPedal_STM32 (U1.26), STPedal_Peripherals (J3.7 R27.1)
OLED_DC: STPedal_STM32 (U1.25), STPedal_Peripherals (J3.6)
OLED_nRST: STPedal_STM32 (U1.24), STPedal_Peripherals (J3.5 R22.1)
POT_1: STPedal_STM32 (U1.14), STPedal_Peripherals (C35.2 R6.2)
POT_2: STPedal_STM32 (U1.15), STPedal_Peripherals (C36.2 R7.2)
POT_3: STPedal_STM32 (U1.16), STPedal_Peripherals (C37.2 R15.2)
POT_4: STPedal_STM32 (U1.17), STPedal_Peripherals (C38.2 R16.2)
SPI1_MOSI: STPedal_STM32 (U1.23), STPedal_Peripherals (J3.4)
SPI1_SCK: STPedal_STM32 (U1.21), STPedal_Peripherals (J3.3)
USB_DATA_N: STPedal_STM32 (U1.44), STPedal_Peripherals (U9.6)
USB_DATA_P: STPedal_STM32 (U1.45), STPedal_Peripherals (U9.4)